# EAGLE design 7segement4digits1badidea-mk-2-smd (EAGLE 6.5.0)
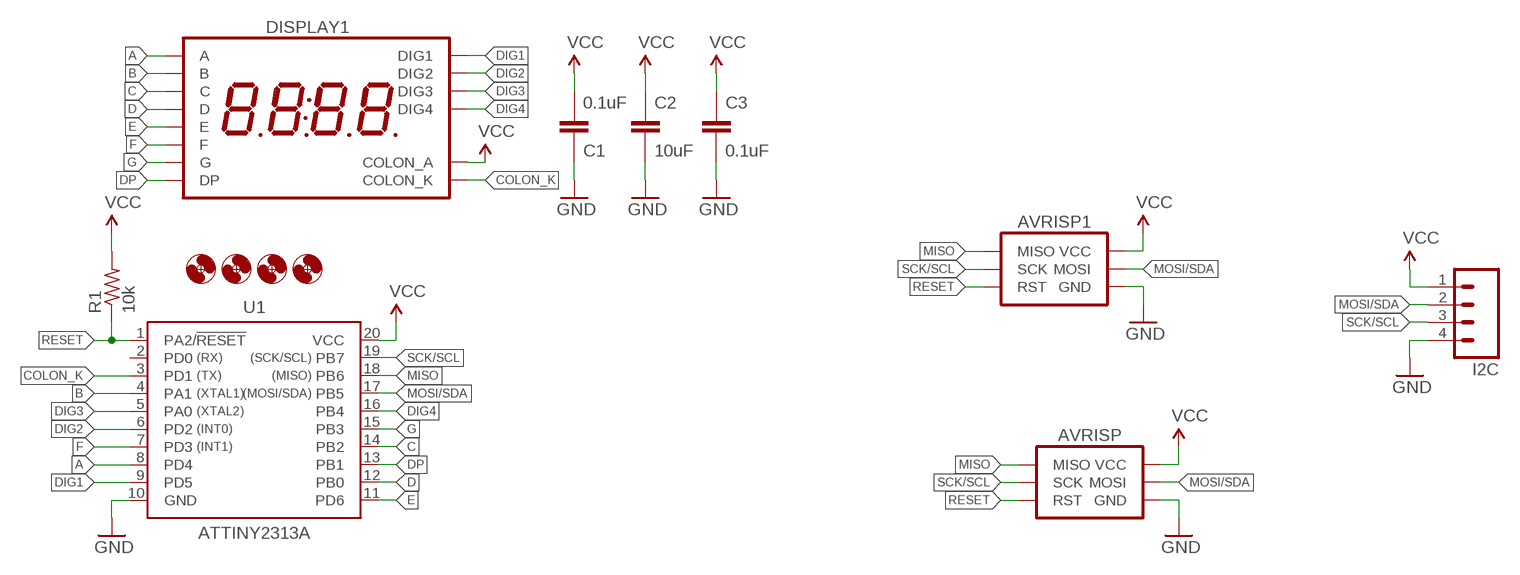
[diagram p0: schematic, sheet 1]

## Parts
AVRISP  AVR_SPI_PRG_6PTH  [2X3]
AVRISP1  AVR_SPI_PRG_6SMD-RA-FLOPPED-I2C  [1X06-SMD]
C1  0.1uF  CAPACITOR-CERAMICC0805  [C0805]
C2  10uF  CAPACITOR-CERAMICC0805  [C0805]
C3  0.1uF  CAPACITOR-CERAMICC0805  [C0805]
DISPLAY1  7SED_4DIGIT_14MM14.2MM-CC  [7SEG_4DIG]
H1  HOLE#2  [HOLE-#2]
H2  HOLE#2  [HOLE-#2]
H3  HOLE#2  [HOLE-#2]
H4  HOLE#2  [HOLE-#2]
I2C  M04PTH  [1X04-PTH-VERT]
R1  10k  RESISTORR0805  [R0805]
U1  ATTINY2313A  ATTINY2313ASOIC  [SOP20W]

## Nets
A: DISPLAY1.P$13(A) U1.8(PD4)
B: DISPLAY1.P$9(B) U1.4(PA1)
C: DISPLAY1.P$4(C) U1.14(PB2)
COLON_K: DISPLAY1.P$7(COLON_K) U1.3(PD1)
D: DISPLAY1.P$2(D) U1.12(PB0)
DIG1: DISPLAY1.P$14(DIG1) U1.9(PD5)
DIG2: DISPLAY1.P$11(DIG2) U1.6(PD2)
DIG3: DISPLAY1.P$10(DIG3) U1.5(PA0)
DIG4: DISPLAY1.P$6(DIG4) U1.16(PB4)
DP: DISPLAY1.P$3(DP) U1.13(PB1)
E: DISPLAY1.P$1(E) U1.11(PD6)
F: DISPLAY1.P$12(F) U1.7(PD3)
G: DISPLAY1.P$5(G) U1.15(PB3)
GND: AVRISP1.4(GND) AVRISP.6(GND) C1.1 C2.2 C3.2 I2C.4 U1.10(GND)
MISO: AVRISP1.5(MISO) AVRISP.1(MISO) U1.18(PB6)
MOSI/SDA: AVRISP1.3(MOSI) AVRISP.4(MOSI) I2C.2 U1.17(PB5)
RESET: AVRISP1.6(RST) AVRISP.5(RST) R1.1 U1.1(PA2/!RESET)
SCK/SCL: AVRISP1.2(SCK) AVRISP.3(SCK) I2C.3 U1.19(PB7)
VCC: AVRISP1.1(VCC) AVRISP.2(VCC) C1.2 C2.1 C3.1 DISPLAY1.P$8(COLON_A) I2C.1 R1.2 U1.20(VCC)
Unconnected: U1.2(PD0)

## Library data of the parts
AVRISP AVRISP1 = A_butts:AVR_SPI_PRG_6: AVR ISP 6 Pin This is the reduced ISP connector for AVR programming. Common on Arduino. This footprint will take up less PCB space and can be used with a 10-pin to 6-pin adapter such as SKU: BOB-08508 **Special note about "TEST_POINT" package. The stop mask is on the top side, so if you want your programming test points to be on the bottom of your board, make sure to place this package on the bottom side of the board. This also ensure that the orientation to program from the bottom side will be correct.
C1-C3 = A_butts:CAPACITOR-CERAMIC: CAPACITOR, European symbol
DISPLAY1 = A_butts:7SED_4DIGIT_14MM
H1-H4 = A_butts:HOLE: MOUNTING HOLE with drill center marker
I2C = A_butts:M04: Header 4 Standard 4-pin 0.1" header. Use with straight break away headers (SKU : PRT-00116), right angle break away headers (PRT-00553), swiss pins (PRT-00743), machine pins (PRT-00117), and female headers (PRT-00115). Molex polarized connector foot print use with SKU : PRT-08231 with associated crimp pins and housings. 1MM SMD Version SKU: PRT-10208
R1 = A_butts:RESISTOR: RESISTOR, American symbol
U1 = A_butts:ATTINY2313A: ATTINY2313A 2kB 20MHz I2C/SPI/UART; PROD_ID: IC-11305

## Board
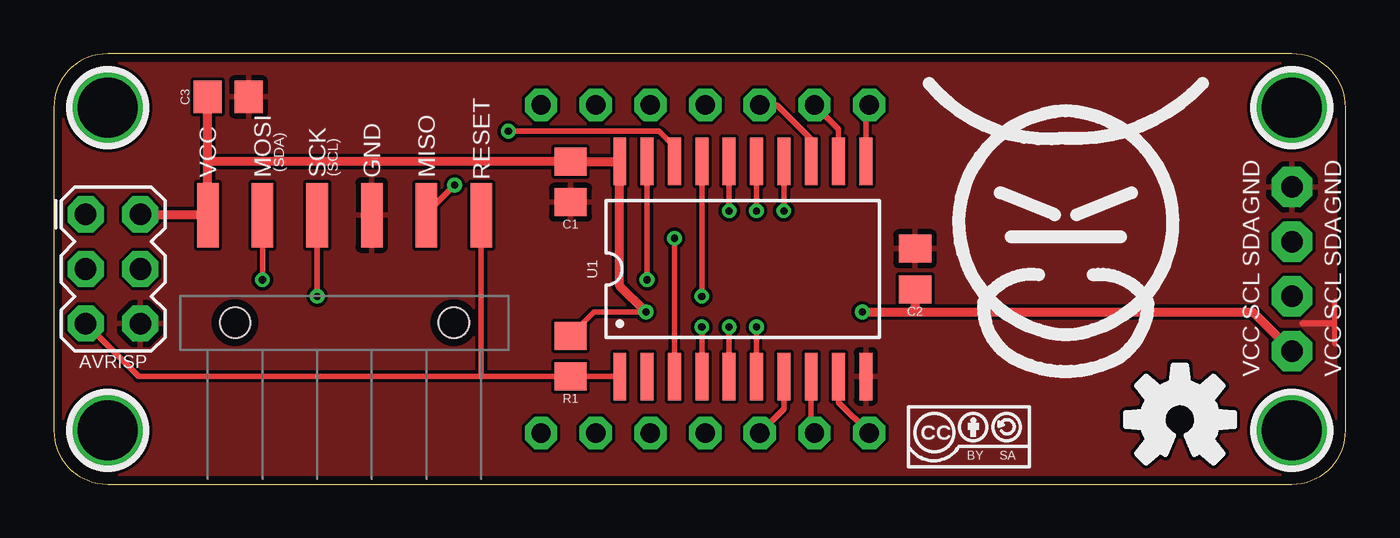
[diagram p1: board, top side]
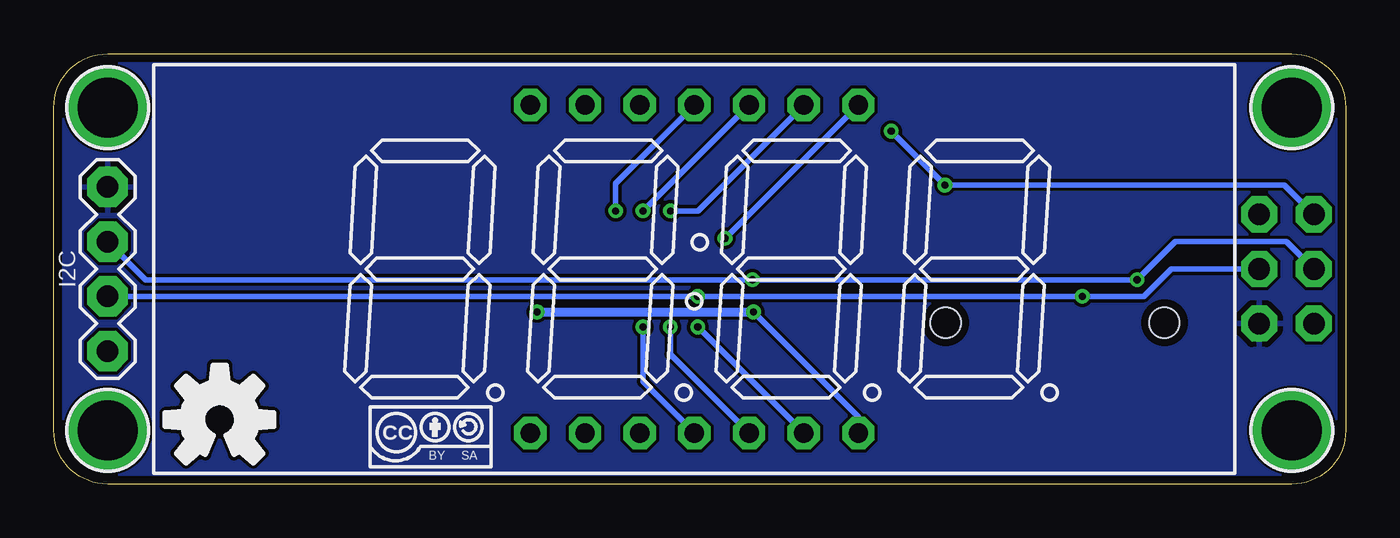
[diagram p2: board, bottom side, seen from below]

Size 60 x 20 mm. Coordinates in mm from the lower left corner, seen from the top.
Outline: 0,17.5 0,2.5 arc90 2.5,0 57.5,0 arc90 60,2.5 60,17.5 arc90 57.5,20 2.5,20 arc90 0,17.5
Copper layers (1*16): Top 0.0356mm / dielectric 1.5011mm / Bottom 0.0356mm
Design rules "LaenPCBOrder2": minimum track width 6mil, minimum drill 13mil, track to track 6mil, track to pad 6mil, pad to pad 6mil, via to via 6mil, smd to smd 6mil, copper to edge 15mil, drill to drill 6mil, minimum pad ring 7mil, minimum via ring 7mil, stop-mask expansion 3mil, vias tented up to drill 20mil, thermal gap 10mil

### Footprints (pad centres in the part's own frame; a part is rotated, then mirrored left to right if it is on the bottom)
2X3 = drill 1 pad 1.676 octagon: 1 -2.54,-1.27; 2 -2.54,1.27; 3 0,-1.27; 4 0,1.27; 5 2.54,-1.27; 6 2.54,1.27
1X06-SMD = smd 1 x 3: 1 -6.35,5; 2 -3.81,5; 3 -1.27,5; 4 1.27,5; 5 3.81,5; 6 6.35,5 | hole 1.4: -5.08,0; 5.08,0
C0805 = smd 1.3 x 1.5: 1 -0.95,0; 2 0.95,0
7SEG_4DIG = drill 0.9 pad 1.5 octagon: P$1 -7.62,7.62; P$2 -5.08,7.62; P$3 -2.54,7.62; P$4 0,7.62; P$5 2.54,7.62; P$6 5.08,7.62; P$7 7.62,7.62; P$8 7.62,-7.62; P$9 5.08,-7.62; P$10 2.54,-7.62; P$11 0,-7.62; P$12 -2.54,-7.62; P$13 -5.08,-7.62; P$14 -7.62,-7.62
HOLE-#2 = drill 2.8 pad 3.81: P$1 0,0
1X04-PTH-VERT = drill 1 pad 1.88 octagon: 1 0,0; 2 2.54,0; 3 5.08,0; 4 7.62,0
R0805 = smd 1.3 x 1.5: 1 -0.95,0; 2 0.95,0
SOP20W = smd 0.6 x 2.2: 1 -5.715,-5; 2 -4.445,-5; 3 -3.175,-5; 4 -1.905,-5; 5 -0.635,-5; 6 0.635,-5; 7 1.905,-5; 8 3.175,-5; 9 4.445,-5; 10 5.715,-5; 11 5.715,5; 12 4.445,5; 13 3.175,5; 14 1.905,5; 15 0.635,5; 16 -0.635,5; 17 -1.905,5; 18 -3.175,5; 19 -4.445,5; 20 -5.715,5

### Placement (x,y rotation side)
AVRISP  2.75,10 270 top
AVRISP1  13.5,7.5 0 top
C1  24,14.05 90 top
C2  40,10 90 top
C3  8.09,18 0 top
DISPLAY1  30.25,10 0 bottom
H1  2.5,2.5 0 top
H2  2.5,17.5 0 top
H3  57.5,2.5 0 top
H4  57.5,17.5 0 top
I2C  57.5,6.19 90 bottom
R1  24,5.95 90 top
U1  32,10 0 top
U$1  [COW]  47,11 0 top
U$2  [CC-BY-SA-4.0-NO-URL]  42.5,2.2 0 top
U$3  [OSHWLOGO_TOP_0.2_A]  52.3,3 0 top
U$4  [OSHWLOGO_TOP_0.2_A]  52.3,3 0 bottom
U$5  [CC-BY-SA-4.0-NO-URL]  42.5,2.2 0 bottom

### Tracks (layer width: path | path; a pad name or v marks a point on that pad's centre or on a via)
A
  Top 0.25: U1.8 35.17,2.54 DISPLAY1.P$13
B  (via drill 0.33)
  Top 0.25: U1.4 v30.09,7.3
  Bottom 0.25: v30.09,7.3 DISPLAY1.P$9
C  (via drill 0.33)
  Top 0.25: U1.14 v33.91,12.7
  Bottom 0.25: DISPLAY1.P$4 33.91,13.96 v33.91,12.7
COLON_K  (via drill 0.33)
  Top 0.25: U1.3 v28.82,11.43
  Bottom 0.25: v28.82,11.43 DISPLAY1.P$7
D
  Top 0.25: U1.12 36.45,16.5 DISPLAY1.P$2
DIG1
  Top 0.25: U1.9 36.45,3.81 DISPLAY1.P$14
DIG2  (via drill 0.33)
  Top 0.25: U1.6 v32.63,7.3
  Bottom 0.25: v32.63,7.3 32.63,4.76 DISPLAY1.P$11
DIG3  (via drill 0.33)
  Top 0.25: U1.5 v31.36,7.3
  Bottom 0.25: v31.36,7.3 31.36,6.04 DISPLAY1.P$10
DIG4  (via drill 0.33)
  Top 0.25: U1.16 v31.36,12.7
  Bottom 0.25: DISPLAY1.P$6 30.09,12.7 v31.36,12.7
DP
  Top 0.25: U1.13 35.17,16.02 33.58,17.62 DISPLAY1.P$3
E
  Top 0.25: U1.11 37.72,17.46 DISPLAY1.P$1
F
  Top 0.25: U1.7 33.91,3.5 DISPLAY1.P$12
G  (via drill 0.33)
  Top 0.25: U1.15 v32.63,12.7
  Bottom 0.25: DISPLAY1.P$5 v32.63,12.7
GND
  Top 0.238: 59.5,6.5 59.5,8.5
  Top 0.305: 58,7.46 59.4,7.46
  pour Top: 2.5,20 57.5,20 arc-90 60,17.5 60,2.5 arc-90 57.5,0 2.5,0 arc-90 0,2.5 0,17.5 arc-90
  pour Bottom: 2.5,20 57.5,20 arc-90 60,17.5 60,2.5 arc-90 57.5,0 2.5,0 arc-90 0,2.5 0,17.5 arc-90
MISO  (via drill 0.33)
  Top 0.25: v21.11,16.4 28.1,16.4 28.82,15.68 U1.18 | v18.61,13.9 17.31,12.6 AVRISP1.5
  Bottom 0.25: AVRISP.1 2.84,13.9 v18.61,13.9 v21.11,16.4
MOSI/SDA  (via drill 0.33)
  Top 0.25: U1.17 v30.09,8.73 | AVRISP1.3 v12.23,8.73
  Bottom 0.25: I2C.2 v30.09,8.73 v12.23,8.73 9.37,8.73 8.1,10 AVRISP.4
RESET
  Top 0.25: U1.1 R1.1 19.9,5 | 19.9,5 3.94,5 AVRISP.5 | AVRISP1.6 19.85,5.05 19.9,5
SCK/SCL  (via drill 0.33)
  Top 0.25: U1.19 v27.55,9.5 | AVRISP1.2 v9.69,9.5
  Bottom 0.25: I2C.3 55.73,9.5 v27.55,9.5 v9.69,9.5 7.92,11.27 2.75,11.27 AVRISP.3
VCC  (via drill 0.33)
  Top 0.25: R1.2 25.1,8 v27.5,8
  Top 0.406: v27.5,8 26.29,9.21 U1.20 C1.2 7.25,15 7.15,15.1 | C2.1 40,8 | v37.55,8 40,8 | AVRISP.2 7.11,12.54 AVRISP1.1 7.15,15.1 | 7.15,15.1 C3.1 | 40,8 55.69,8 I2C.1
  Bottom 0.25: DISPLAY1.P$8 22.63,3.13 v27.5,8
  Bottom 0.406: v37.55,8 v27.5,8

### Text on the board
tPlace: VCC | MOSI | (SDA) | SCK | (SCL) | GND | MISO | RESET | GND | GND | SDA | SDA | SCL | SCL | VCC | VCC